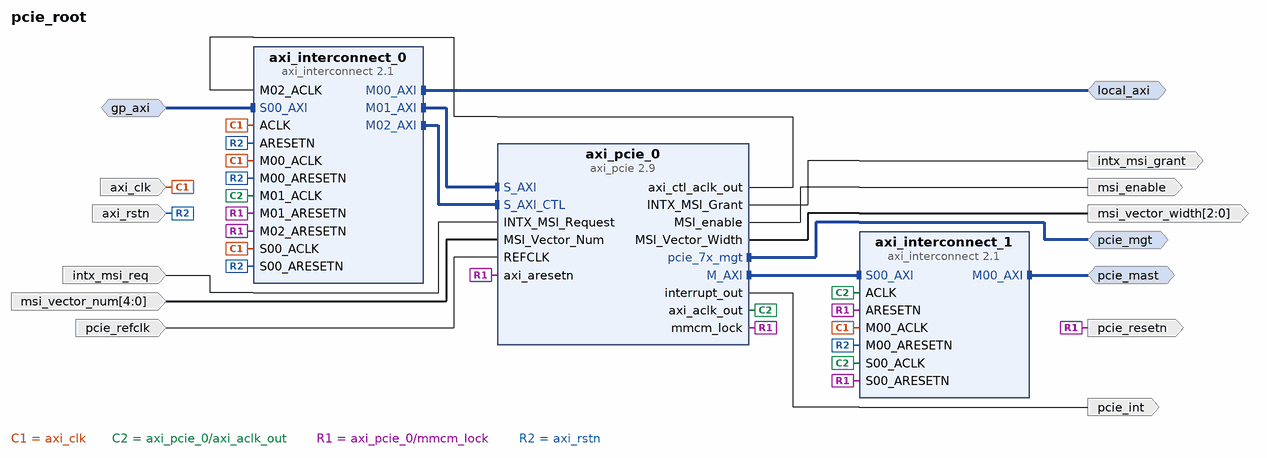
[diagram p0: block diagram of the top level]
# Vivado block design pcie_root, xc7z030fbg484-2, Vivado 2024.1
create_bd_design pcie_root

create_bd_intf_port -mode Master -vlnv xilinx.com:interface:aximm_rtl:1.0 local_axi
set_property -dict [list \
  CONFIG.ADDR_WIDTH 32 \
  CONFIG.DATA_WIDTH 32 \
  CONFIG.FREQ_HZ 125000000 \
  CONFIG.PROTOCOL AXI3 \
] [get_bd_intf_ports local_axi]
create_bd_intf_port -mode Slave -vlnv xilinx.com:interface:aximm_rtl:1.0 gp_axi
set_property -dict [list \
  CONFIG.ADDR_WIDTH 32 \
  CONFIG.ARUSER_WIDTH 0 \
  CONFIG.AWUSER_WIDTH 0 \
  CONFIG.BUSER_WIDTH 0 \
  CONFIG.DATA_WIDTH 32 \
  CONFIG.FREQ_HZ 125000000 \
  CONFIG.HAS_BRESP 1 \
  CONFIG.HAS_BURST 1 \
  CONFIG.HAS_CACHE 1 \
  CONFIG.HAS_LOCK 1 \
  CONFIG.HAS_PROT 1 \
  CONFIG.HAS_QOS 1 \
  CONFIG.HAS_REGION 1 \
  CONFIG.HAS_RRESP 1 \
  CONFIG.HAS_WSTRB 1 \
  CONFIG.ID_WIDTH 12 \
  CONFIG.MAX_BURST_LENGTH 16 \
  CONFIG.NUM_READ_OUTSTANDING 8 \
  CONFIG.NUM_READ_THREADS 1 \
  CONFIG.NUM_WRITE_OUTSTANDING 8 \
  CONFIG.NUM_WRITE_THREADS 1 \
  CONFIG.PROTOCOL AXI3 \
  CONFIG.READ_WRITE_MODE READ_WRITE \
  CONFIG.RUSER_BITS_PER_BYTE 0 \
  CONFIG.RUSER_WIDTH 0 \
  CONFIG.SUPPORTS_NARROW_BURST 1 \
  CONFIG.WUSER_BITS_PER_BYTE 0 \
  CONFIG.WUSER_WIDTH 0 \
] [get_bd_intf_ports gp_axi]
create_bd_intf_port -mode Master -vlnv xilinx.com:interface:aximm_rtl:1.0 pcie_mast
set_property -dict [list \
  CONFIG.ADDR_WIDTH 32 \
  CONFIG.DATA_WIDTH 64 \
  CONFIG.FREQ_HZ 125000000 \
  CONFIG.HAS_BURST 1 \
  CONFIG.HAS_QOS 1 \
  CONFIG.HAS_REGION 1 \
  CONFIG.NUM_READ_OUTSTANDING 1 \
  CONFIG.NUM_WRITE_OUTSTANDING 1 \
  CONFIG.PROTOCOL AXI3 \
] [get_bd_intf_ports pcie_mast]
create_bd_intf_port -mode Master -vlnv xilinx.com:interface:pcie_7x_mgt_rtl:1.0 pcie_mgt
create_bd_port -dir I -type clk axi_clk
set_property -dict {CONFIG.ASSOCIATED_RESET axi_rstn CONFIG.FREQ_HZ 125000000} [get_bd_ports axi_clk]
create_bd_port -dir O pcie_resetn
create_bd_port -dir I -type rst axi_rstn
set_property -dict {CONFIG.POLARITY ACTIVE_LOW} [get_bd_ports axi_rstn]
create_bd_port -dir O -type intr pcie_int
create_bd_port -dir I -type clk pcie_refclk
set_property -dict {CONFIG.FREQ_HZ 100000000} [get_bd_ports pcie_refclk]
create_bd_port -dir I intx_msi_req
create_bd_port -dir I -from 4 -to 0 msi_vector_num
create_bd_port -dir O intx_msi_grant
create_bd_port -dir O msi_enable
create_bd_port -dir O -from 2 -to 0 msi_vector_width

create_bd_cell -type ip -vlnv xilinx.com:ip:axi_interconnect:2.1 axi_interconnect_0
set_property -dict [list \
  CONFIG.ENABLE_ADVANCED_OPTIONS 0 \
  CONFIG.ENABLE_PROTOCOL_CHECKERS 0 \
  CONFIG.M00_HAS_DATA_FIFO 0 \
  CONFIG.M01_HAS_DATA_FIFO 0 \
  CONFIG.M02_HAS_DATA_FIFO 0 \
  CONFIG.NUM_MI 3 \
  CONFIG.S00_HAS_DATA_FIFO 0 \
] [get_bd_cells axi_interconnect_0]
create_bd_cell -type ip -vlnv xilinx.com:ip:axi_interconnect:2.1 axi_interconnect_1
set_property -dict [list \
  CONFIG.ENABLE_ADVANCED_OPTIONS 0 \
  CONFIG.ENABLE_PROTOCOL_CHECKERS 1 \
  CONFIG.NUM_MI 1 \
  CONFIG.S00_HAS_DATA_FIFO 0 \
  CONFIG.XBAR_DATA_WIDTH 64 \
] [get_bd_cells axi_interconnect_1]
create_bd_cell -type ip -vlnv xilinx.com:ip:axi_pcie:2.9 axi_pcie_0
set_property -dict [list \
  CONFIG.AXIBAR2PCIEBAR_0 0xb0000000 \
  CONFIG.AXIBAR_AS_0 true \
  CONFIG.BAR0_SCALE Gigabytes \
  CONFIG.BAR0_SIZE 1 \
  CONFIG.BAR_64BIT true \
  CONFIG.BASEADDR 0x00000000 \
  CONFIG.BASE_CLASS_MENU Bridge_device \
  CONFIG.CLASS_CODE 0x060400 \
  CONFIG.COMP_TIMEOUT 50ms \
  CONFIG.DEVICE_ID 0x3001 \
  CONFIG.ENABLE_CLASS_CODE false \
  CONFIG.HIGHADDR 0x001FFFFF \
  CONFIG.INCLUDE_RC Root_Port_of_PCI_Express_Root_Complex \
  CONFIG.M_AXI_DATA_WIDTH 64 \
  CONFIG.NUM_MSI_REQ 5 \
  CONFIG.SUB_CLASS_INTERFACE_MENU PCI_to_PCI_bridge \
  CONFIG.S_AXI_DATA_WIDTH 64 \
  CONFIG.VENDOR_ID 0x1A4A \
  CONFIG.en_ext_pipe_interface false \
  CONFIG.enable_jtag_dbg false \
  CONFIG.rp_bar_hide true \
  CONFIG.shared_logic_in_core true \
] [get_bd_cells axi_pcie_0]

# ---- connections ----

connect_bd_intf_net [get_bd_intf_pins axi_interconnect_1/S00_AXI] [get_bd_intf_pins axi_pcie_0/M_AXI]
connect_bd_intf_net [get_bd_intf_pins axi_interconnect_0/M00_AXI] [get_bd_intf_ports local_axi]
connect_bd_intf_net [get_bd_intf_pins axi_interconnect_0/M01_AXI] [get_bd_intf_pins axi_pcie_0/S_AXI]
connect_bd_intf_net [get_bd_intf_pins axi_interconnect_0/M02_AXI] [get_bd_intf_pins axi_pcie_0/S_AXI_CTL]
connect_bd_intf_net [get_bd_intf_pins axi_interconnect_1/M00_AXI] [get_bd_intf_ports pcie_mast]
connect_bd_intf_net [get_bd_intf_pins axi_pcie_0/pcie_7x_mgt] [get_bd_intf_ports pcie_mgt]
connect_bd_intf_net [get_bd_intf_pins axi_interconnect_0/S00_AXI] [get_bd_intf_ports gp_axi]
connect_bd_net -net M02_ACLK_1 [get_bd_pins axi_pcie_0/axi_ctl_aclk_out] [get_bd_pins axi_interconnect_0/M02_ACLK]
connect_bd_net [get_bd_ports axi_clk] \
  [get_bd_pins axi_interconnect_0/ACLK] [get_bd_pins axi_interconnect_0/S00_ACLK] [get_bd_pins axi_interconnect_0/M00_ACLK] \
  [get_bd_pins axi_interconnect_1/M00_ACLK]
connect_bd_net [get_bd_pins axi_pcie_0/INTX_MSI_Grant] [get_bd_ports intx_msi_grant]
connect_bd_net [get_bd_pins axi_pcie_0/MSI_Vector_Width] [get_bd_ports msi_vector_width]
connect_bd_net [get_bd_pins axi_pcie_0/MSI_enable] [get_bd_ports msi_enable]
connect_bd_net [get_bd_pins axi_pcie_0/axi_aclk_out] \
  [get_bd_pins axi_interconnect_0/M01_ACLK] [get_bd_pins axi_interconnect_1/S00_ACLK] [get_bd_pins axi_interconnect_1/ACLK]
connect_bd_net [get_bd_pins axi_pcie_0/interrupt_out] [get_bd_ports pcie_int]
connect_bd_net [get_bd_pins axi_pcie_0/mmcm_lock] \
  [get_bd_ports pcie_resetn] [get_bd_pins axi_pcie_0/axi_aresetn] [get_bd_pins axi_interconnect_0/M01_ARESETN] \
  [get_bd_pins axi_interconnect_0/M02_ARESETN] [get_bd_pins axi_interconnect_1/ARESETN] \
  [get_bd_pins axi_interconnect_1/S00_ARESETN]
connect_bd_net [get_bd_ports axi_rstn] \
  [get_bd_pins axi_interconnect_0/ARESETN] [get_bd_pins axi_interconnect_0/S00_ARESETN] \
  [get_bd_pins axi_interconnect_0/M00_ARESETN] [get_bd_pins axi_interconnect_1/M00_ARESETN]
connect_bd_net [get_bd_ports intx_msi_req] [get_bd_pins axi_pcie_0/INTX_MSI_Request]
connect_bd_net [get_bd_ports msi_vector_num] [get_bd_pins axi_pcie_0/MSI_Vector_Num]
connect_bd_net [get_bd_ports pcie_refclk] [get_bd_pins axi_pcie_0/REFCLK]

# ---- address map ----
assign_bd_address -offset 0x44A00000 -range 64K -target_address_space [get_bd_addr_spaces axi_pcie_0/M_AXI] [get_bd_addr_segs pcie_mast/Reg]
assign_bd_address -offset 0x80000000 -range 512M -target_address_space [get_bd_addr_spaces gp_axi] [get_bd_addr_segs local_axi/Reg]
assign_bd_address -offset 0xA0000000 -range 256M -target_address_space [get_bd_addr_spaces gp_axi] [get_bd_addr_segs axi_pcie_0/S_AXI_CTL/CTL0]
assign_bd_address -offset 0xB0000000 -range 256M -target_address_space [get_bd_addr_spaces gp_axi] [get_bd_addr_segs axi_pcie_0/S_AXI/BAR0]

validate_bd_design
save_bd_design
